# EasyEDA schematic Photodiode plate.json
TITLE: Sheet_1; REV: 1.0; Date: 2024-04-13; Sheet: 1/1; Company: Your Company
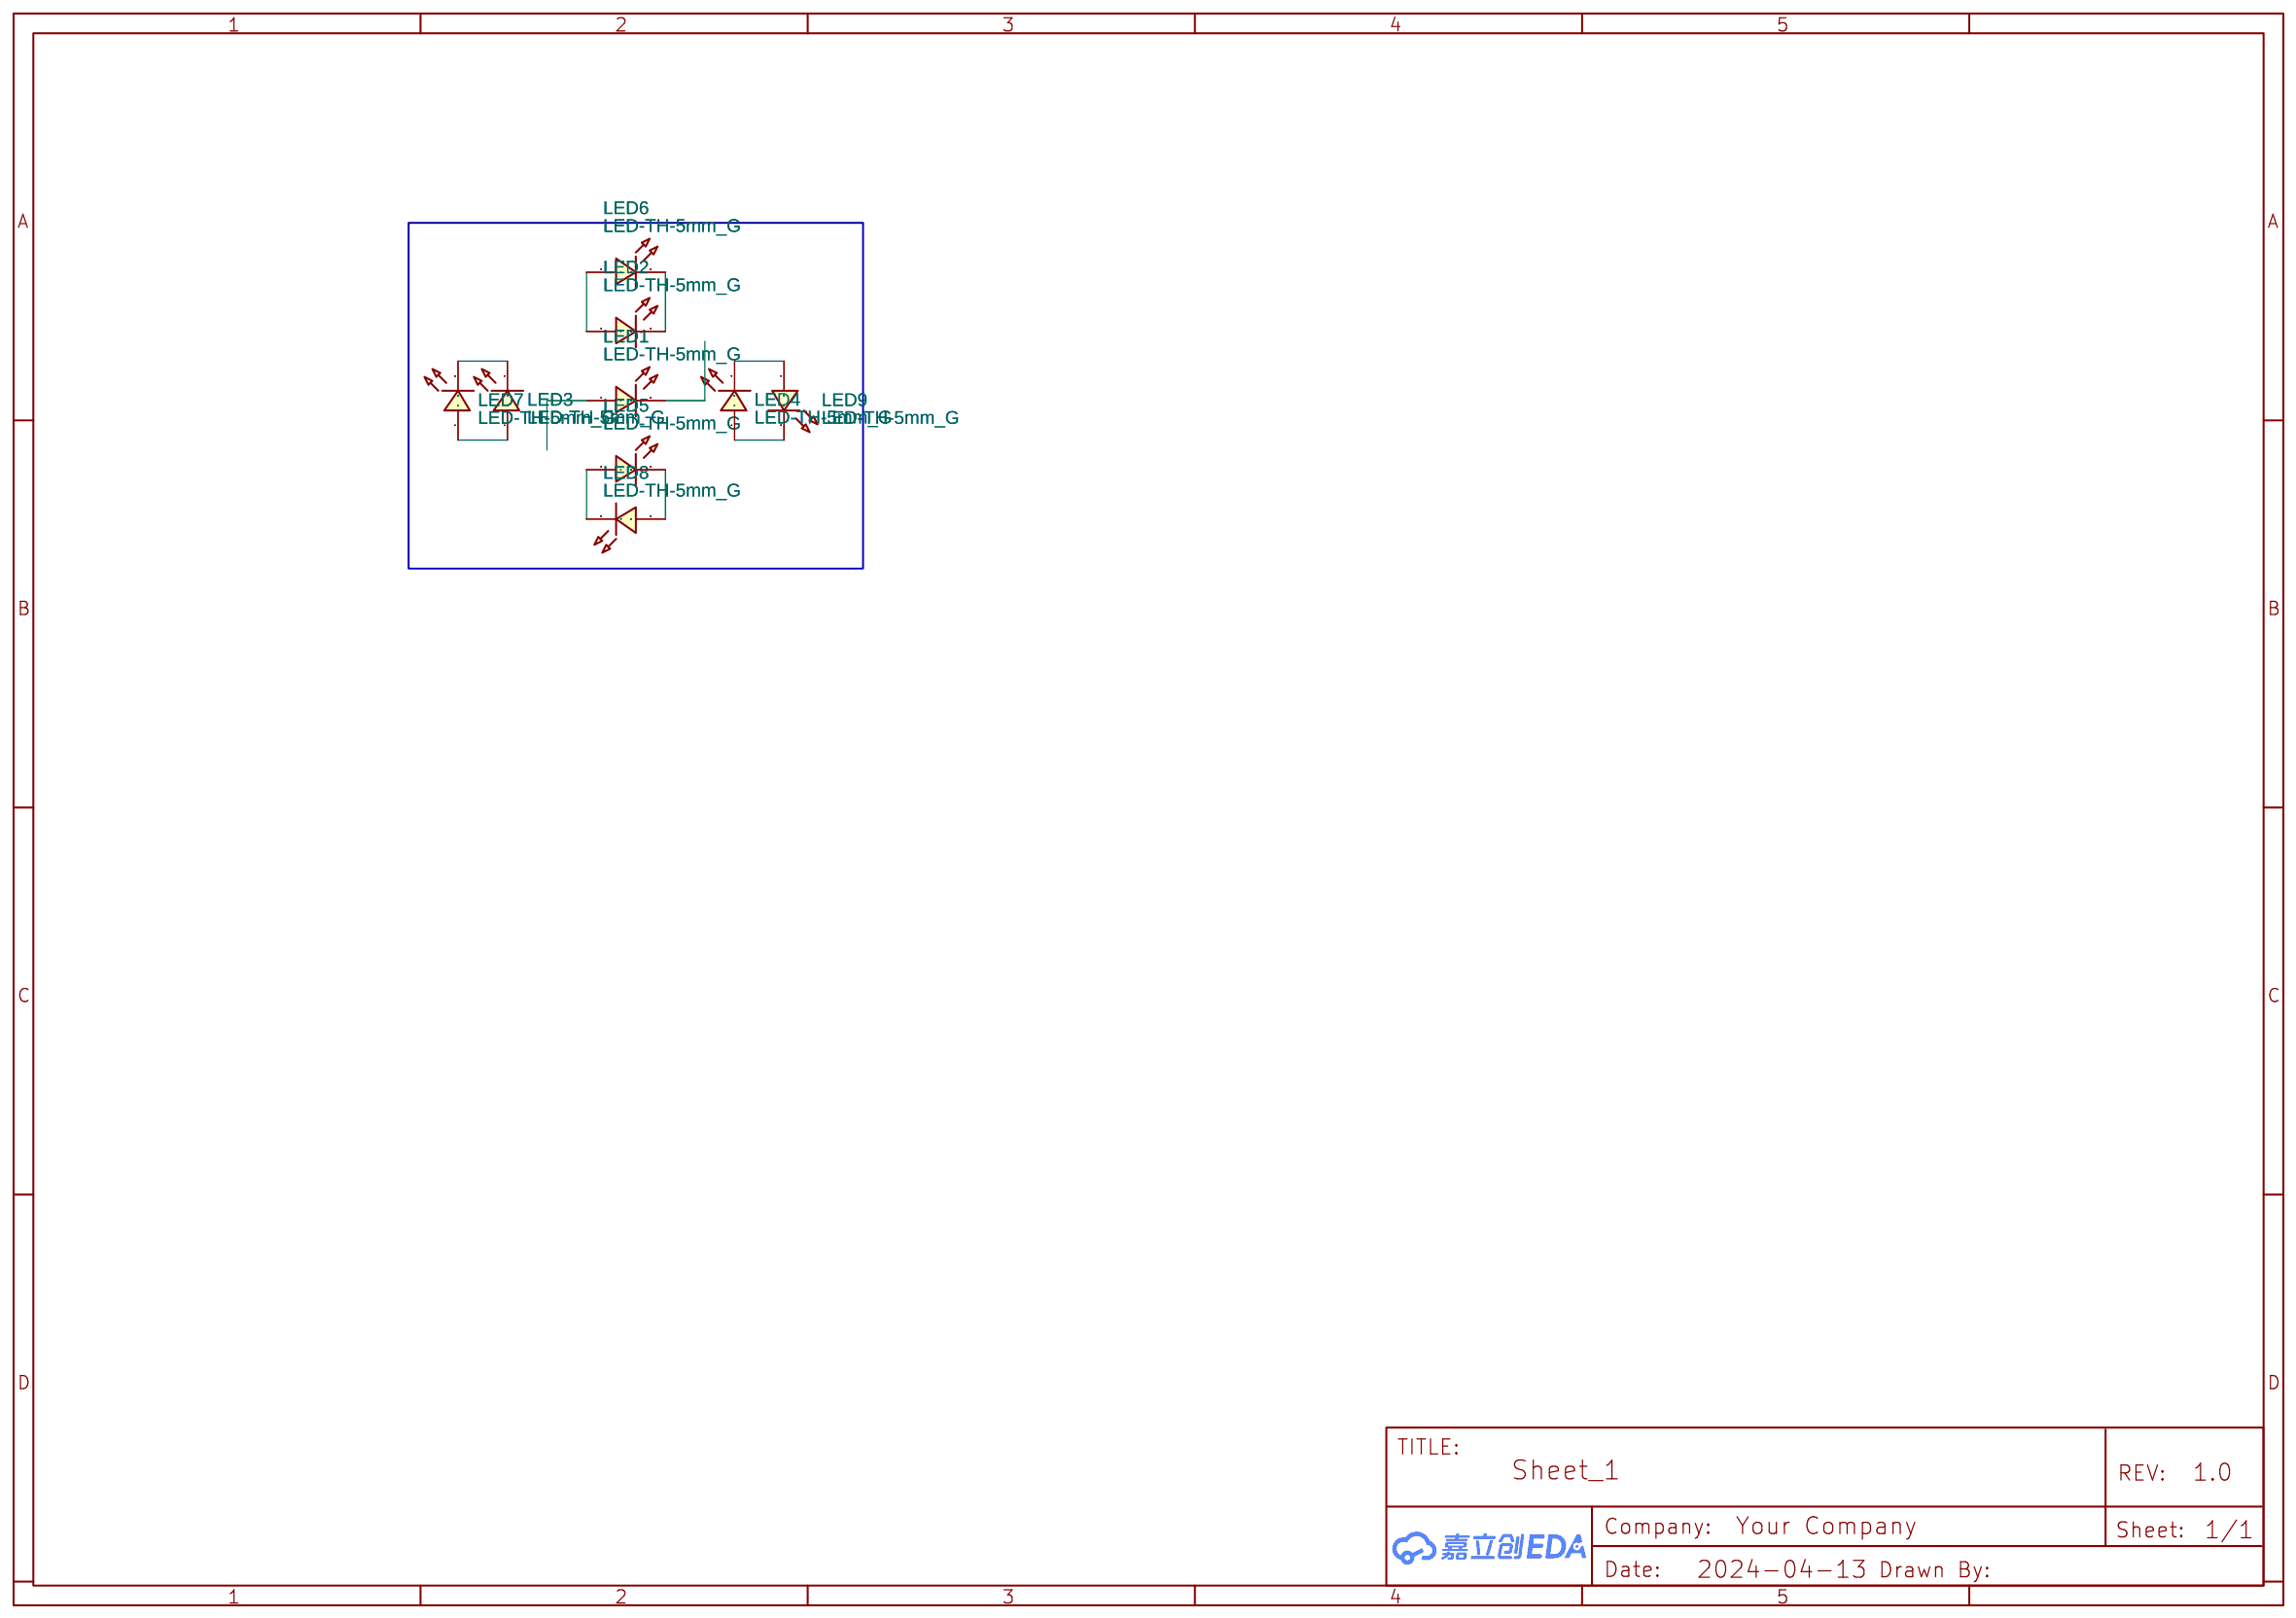
[diagram p0: schematic sheet]

## Parts
LED1  LED-TH-5mm_G  [LED-TH_BD5.0_GREEN]
LED2  LED-TH-5mm_G  [LED-TH_BD5.0_GREEN]
LED3  LED-TH-5mm_G  [LED-TH_BD5.0_GREEN]
LED4  LED-TH-5mm_G  [LED-TH_BD5.0_GREEN]
LED5  LED-TH-5mm_G  [LED-TH_BD5.0_GREEN]
LED6  LED-TH-5mm_G  [LED-TH_BD5.0_GREEN]
LED7  LED-TH-5mm_G  [LED-TH_BD5.0_GREEN]
LED8  LED-TH-5mm_G  [LED-TH_BD5.0_GREEN]
LED9  LED-TH-5mm_G  [LED-TH_BD5.0_GREEN]

## Library data of the parts
LED1-LED9 = LED-TH-5mm_G: Manufacturer: EVERLIGHT(台湾亿光); Manufacturer Part: 333-2SYGD/S530-E2; Supplier Part: C88163; Supplier: LCSC; Contributor: LCEDA_Lib

## Nets
Net-(LED2-1): LED2.1 LED6.1
Net-(LED2-2): LED2.2 LED6.2
Net-(LED3-1): LED3.1 LED7.1
Net-(LED3-2): LED3.2 LED7.2
Net-(LED4-1): LED4.1 LED9.2
Net-(LED4-2): LED4.2 LED9.1
Net-(LED5-1): LED5.1 LED8.2
Net-(LED5-2): LED5.2 LED8.1

Not connected (* = marked no-connect by the designer): LED1 1 2
